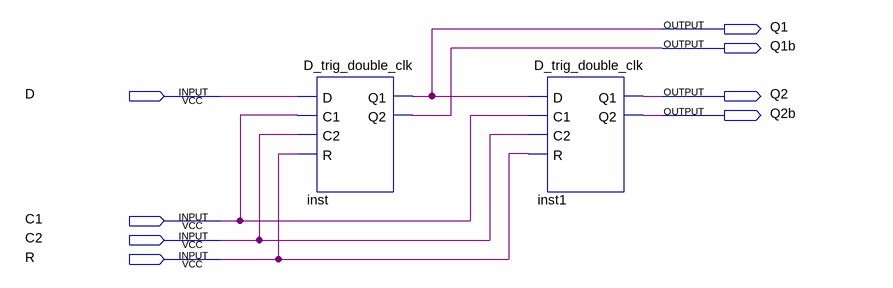
[diagram p0: schematic sheet]
// Quartus schematic double_D_trig_double_clk.bdf as structural Verilog: 2 symbols, 8 pins
module double_D_trig_double_clk (
  input  D,
  input  C1,
  input  C2,
  input  R,
  output Q1,
  output Q1b,
  output Q2,
  output Q2b
);

  D_trig_double_clk inst (.D(D), .C1(C1), .C2(C2), .R(R), .Q1(Q1), .Q2(Q1b));
  D_trig_double_clk inst1 (.D(Q1), .C1(C1), .C2(C2), .R(R), .Q1(Q2), .Q2(Q2b));
endmodule
